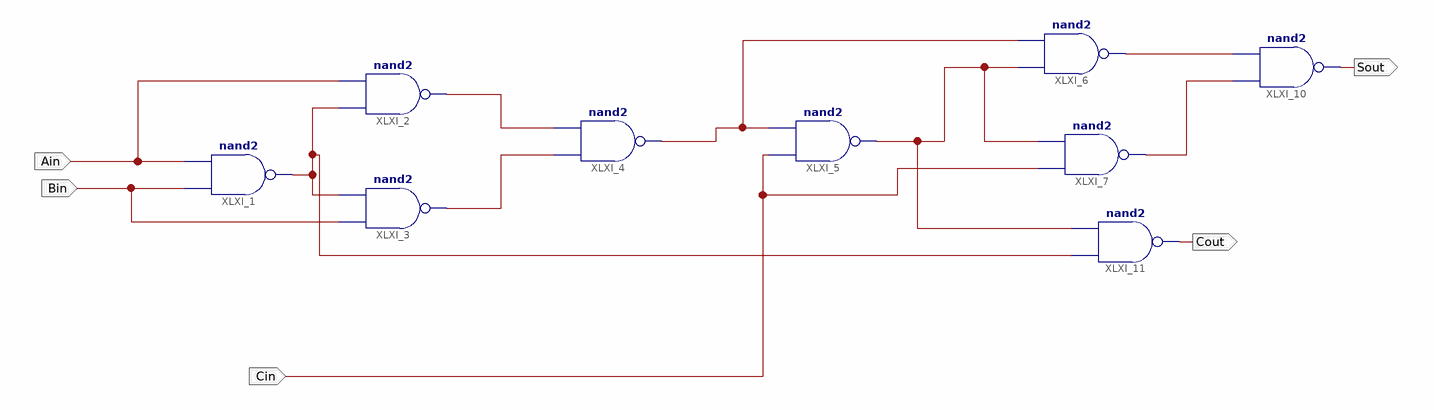
[diagram p0: schematic sheet 1]
// Xilinx ISE schematic FA.sch (spartan3e) as structural Verilog: 9 symbols, 5 ports
module FA (
  input  Bin,
  input  Ain,
  input  Cin,
  output Cout,
  output Sout
);

  wire XLXN_7, XLXN_8, XLXN_9, XLXN_11, XLXN_12, XLXN_17, XLXN_19;

  nand XLXI_1 (XLXN_7, Bin, Ain);
  nand XLXI_2 (XLXN_8, XLXN_7, Ain);
  nand XLXI_3 (XLXN_9, Bin, XLXN_7);
  nand XLXI_4 (XLXN_11, XLXN_9, XLXN_8);
  nand XLXI_5 (XLXN_19, Cin, XLXN_11);
  nand XLXI_6 (XLXN_17, XLXN_19, XLXN_11);
  nand XLXI_7 (XLXN_12, Cin, XLXN_19);
  nand XLXI_10 (Sout, XLXN_12, XLXN_17);
  nand XLXI_11 (Cout, XLXN_7, XLXN_19);
endmodule
